# EAGLE design nodo_sensor_wa4_v1 (EAGLE 8.5.1)

## Sheet 1 of 3: ARDUINO Y COMUNICACION
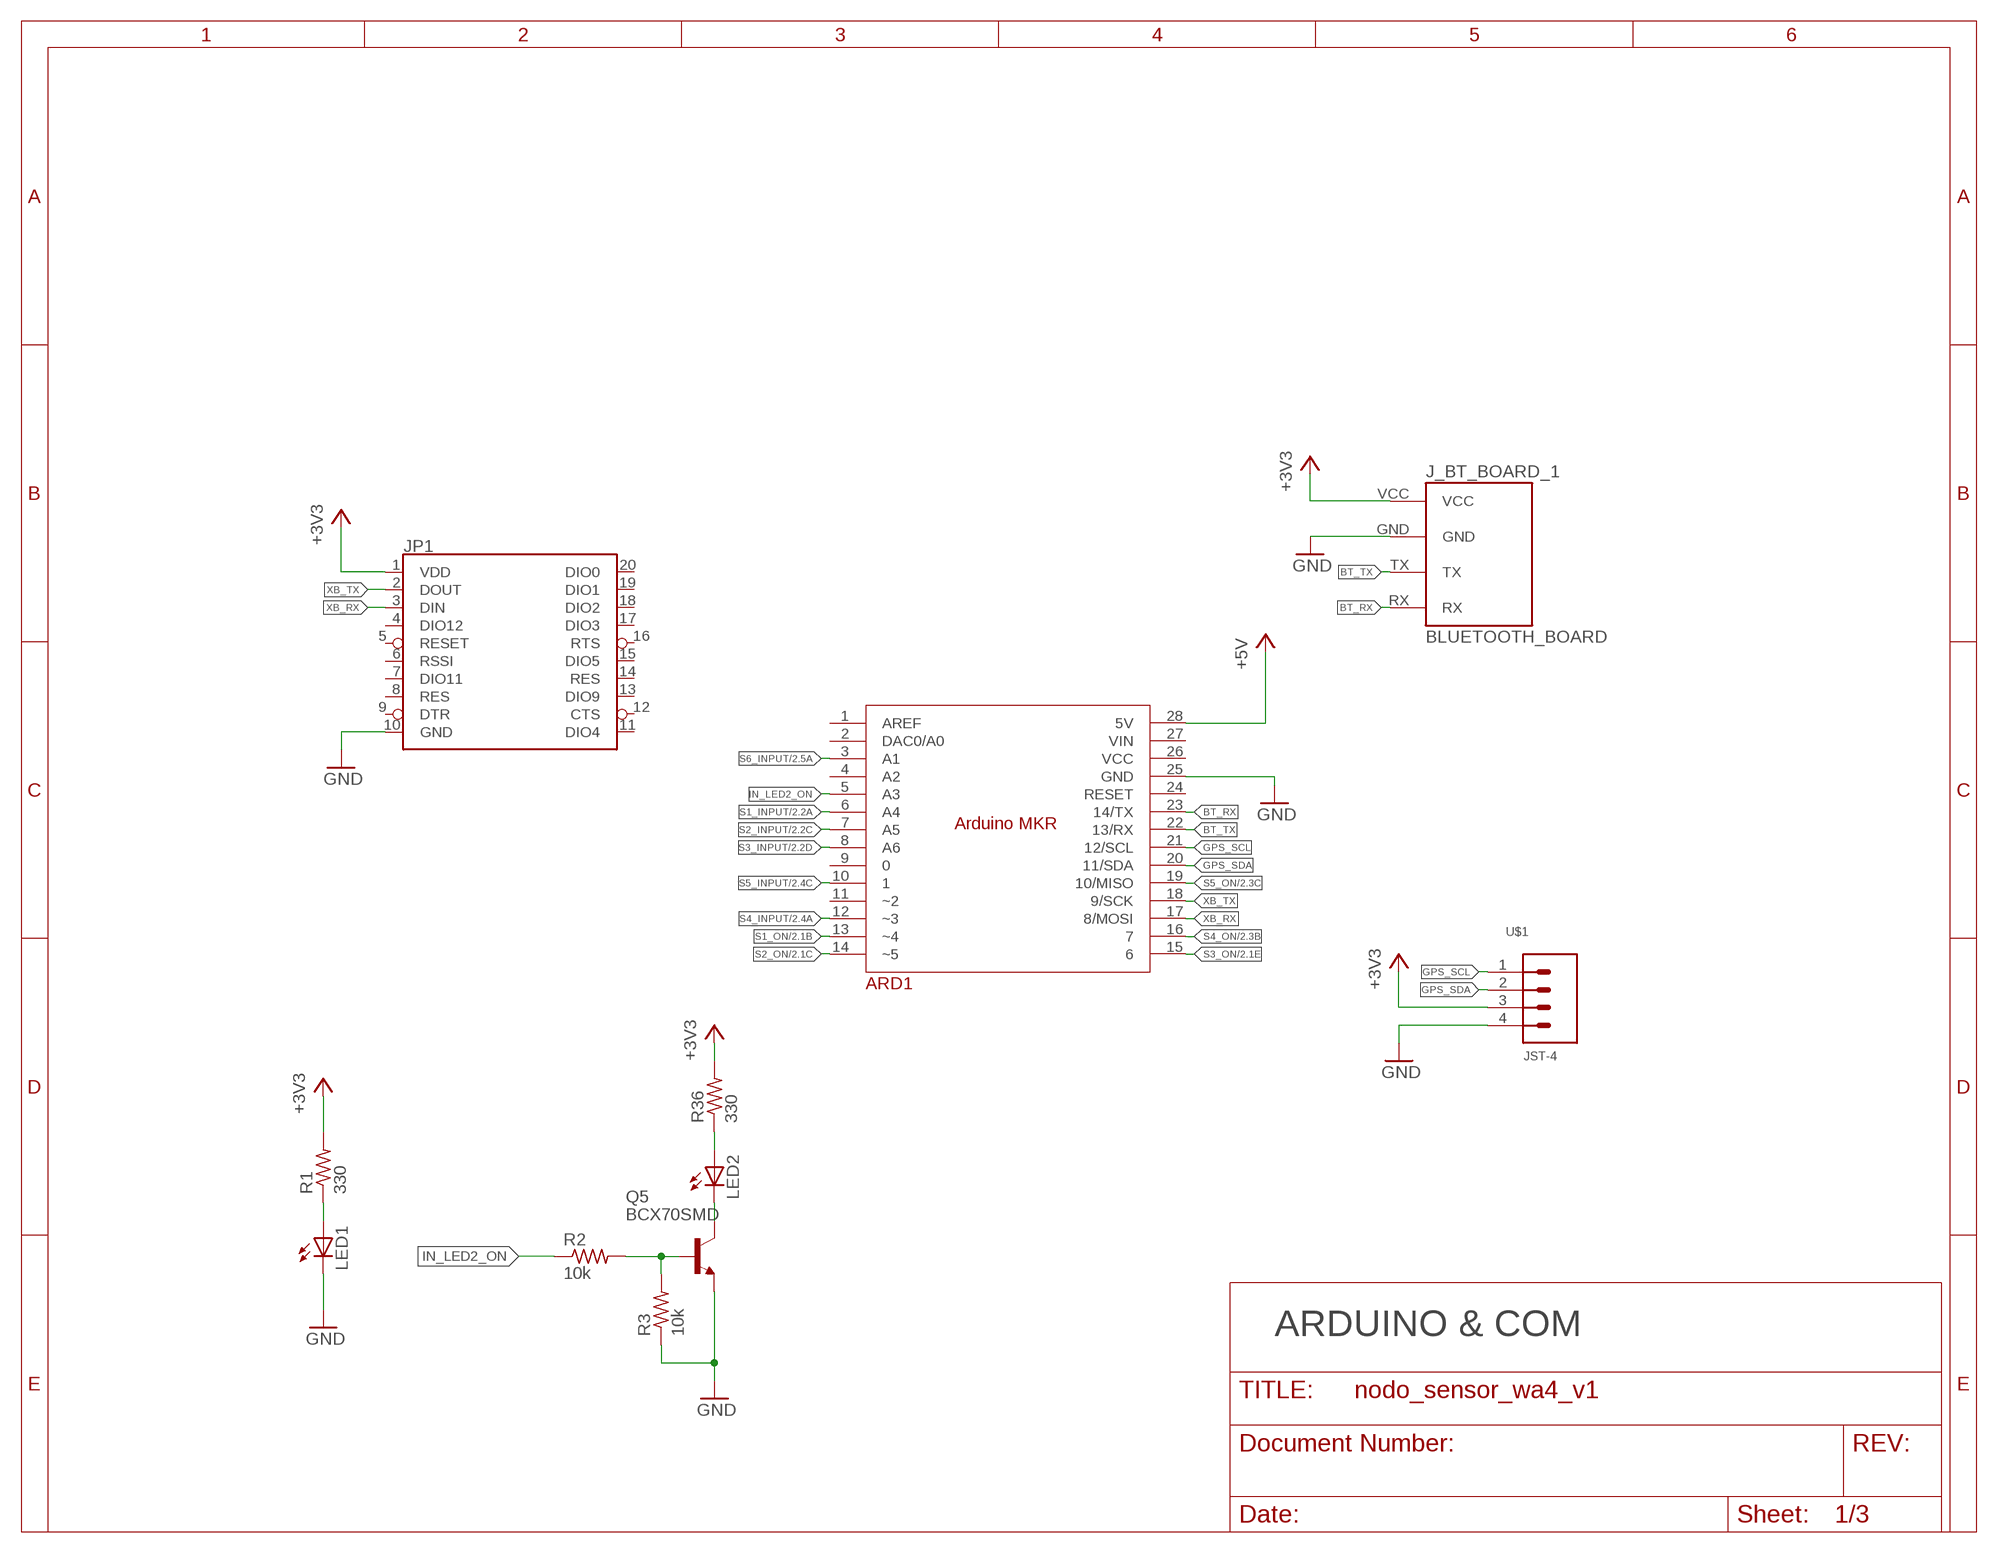
[diagram p0: schematic, sheet 1]

### Parts
ARD1  ARDUINO_MKR  [ARDUINO_MKR]
J_BT_BOARD_1  BLUETOOTH_BOARD  [BT_BOARD_FOOTPRINT]
JP1  XBEE  [XBEE]
LED1  LEDCHIP-LED0805  [CHIP-LED0805]
LED2  LEDCHIP-LED0805  [CHIP-LED0805]
Q5  BCX70SMD  [SOT23]
R1  330  R-US_R0805  [R0805]
R2  10k  R-US_R0805  [R0805]
R3  10k  R-US_R0805  [R0805]
R36  330  R-US_R0805  [R0805]
U$1  JST-4  [JST-4]

### Nets
+3V3: J_BT_BOARD_1.VCC JP1.1(VDD) R1.2 R36.2 U$1.3 ; also sheet 2,3
+5V: ARD1.28(5V) ; also sheet 3
BT_RX: ARD1.23(14/TX) J_BT_BOARD_1.RX
BT_TX: ARD1.22(13/RX) J_BT_BOARD_1.TX
GND: ARD1.25(GND) J_BT_BOARD_1.GND JP1.10(GND) LED1.C Q5.2(E) R3.1 U$1.4 ; also sheet 2,3
GPS_SCL: ARD1.21(12/SCL) U$1.1
GPS_SDA: ARD1.20(11/SDA) U$1.2
IN_LED2_ON: ARD1.5(A3) R2.1
N$38: LED2.A R36.1
N$39: LED2.C Q5.3(C)
N$40: LED1.A R1.1
N$48: Q5.1(B) R2.2 R3.2
S1_INPUT: ARD1.6(A4) ; also sheet 2
S1_ON: ARD1.13(~4) ; also sheet 2
S2_INPUT: ARD1.7(A5) ; also sheet 2
S2_ON: ARD1.14(~5) ; also sheet 2
S3_INPUT: ARD1.8(A6) ; also sheet 2
S3_ON: ARD1.15 ; also sheet 2
S4_INPUT: ARD1.12(~3) ; also sheet 2
S4_ON: ARD1.16 ; also sheet 2
S5_INPUT: ARD1.10 ; also sheet 2
S5_ON: ARD1.19(10/MISO) ; also sheet 2
S6_INPUT: ARD1.3(A1) ; also sheet 2
XB_RX: ARD1.17(8/MOSI) JP1.3(DIN)
XB_TX: ARD1.18(9/SCK) JP1.2(DOUT)
Unconnected: ARD1.1(AREF) ARD1.2(DAC0/A0) ARD1.4(A2) ARD1.9 ARD1.11(~2) ARD1.24(RESET) ARD1.26(VCC) ARD1.27(VIN) JP1.4(DIO12) JP1.5(RESET) JP1.6(RSSI) JP1.7(DIO11) JP1.8(RES) JP1.9(DTR) JP1.11(DIO4) JP1.12(CTS) JP1.13(DIO9) JP1.14(RES) JP1.15(DIO5) JP1.16(RTS) JP1.17(DIO3) JP1.18(DIO2) JP1.19(DIO1) JP1.20(DIO0)

### Notes on the sheet
- ARDUINO & COM

## Sheet 2 of 3: SENSORES
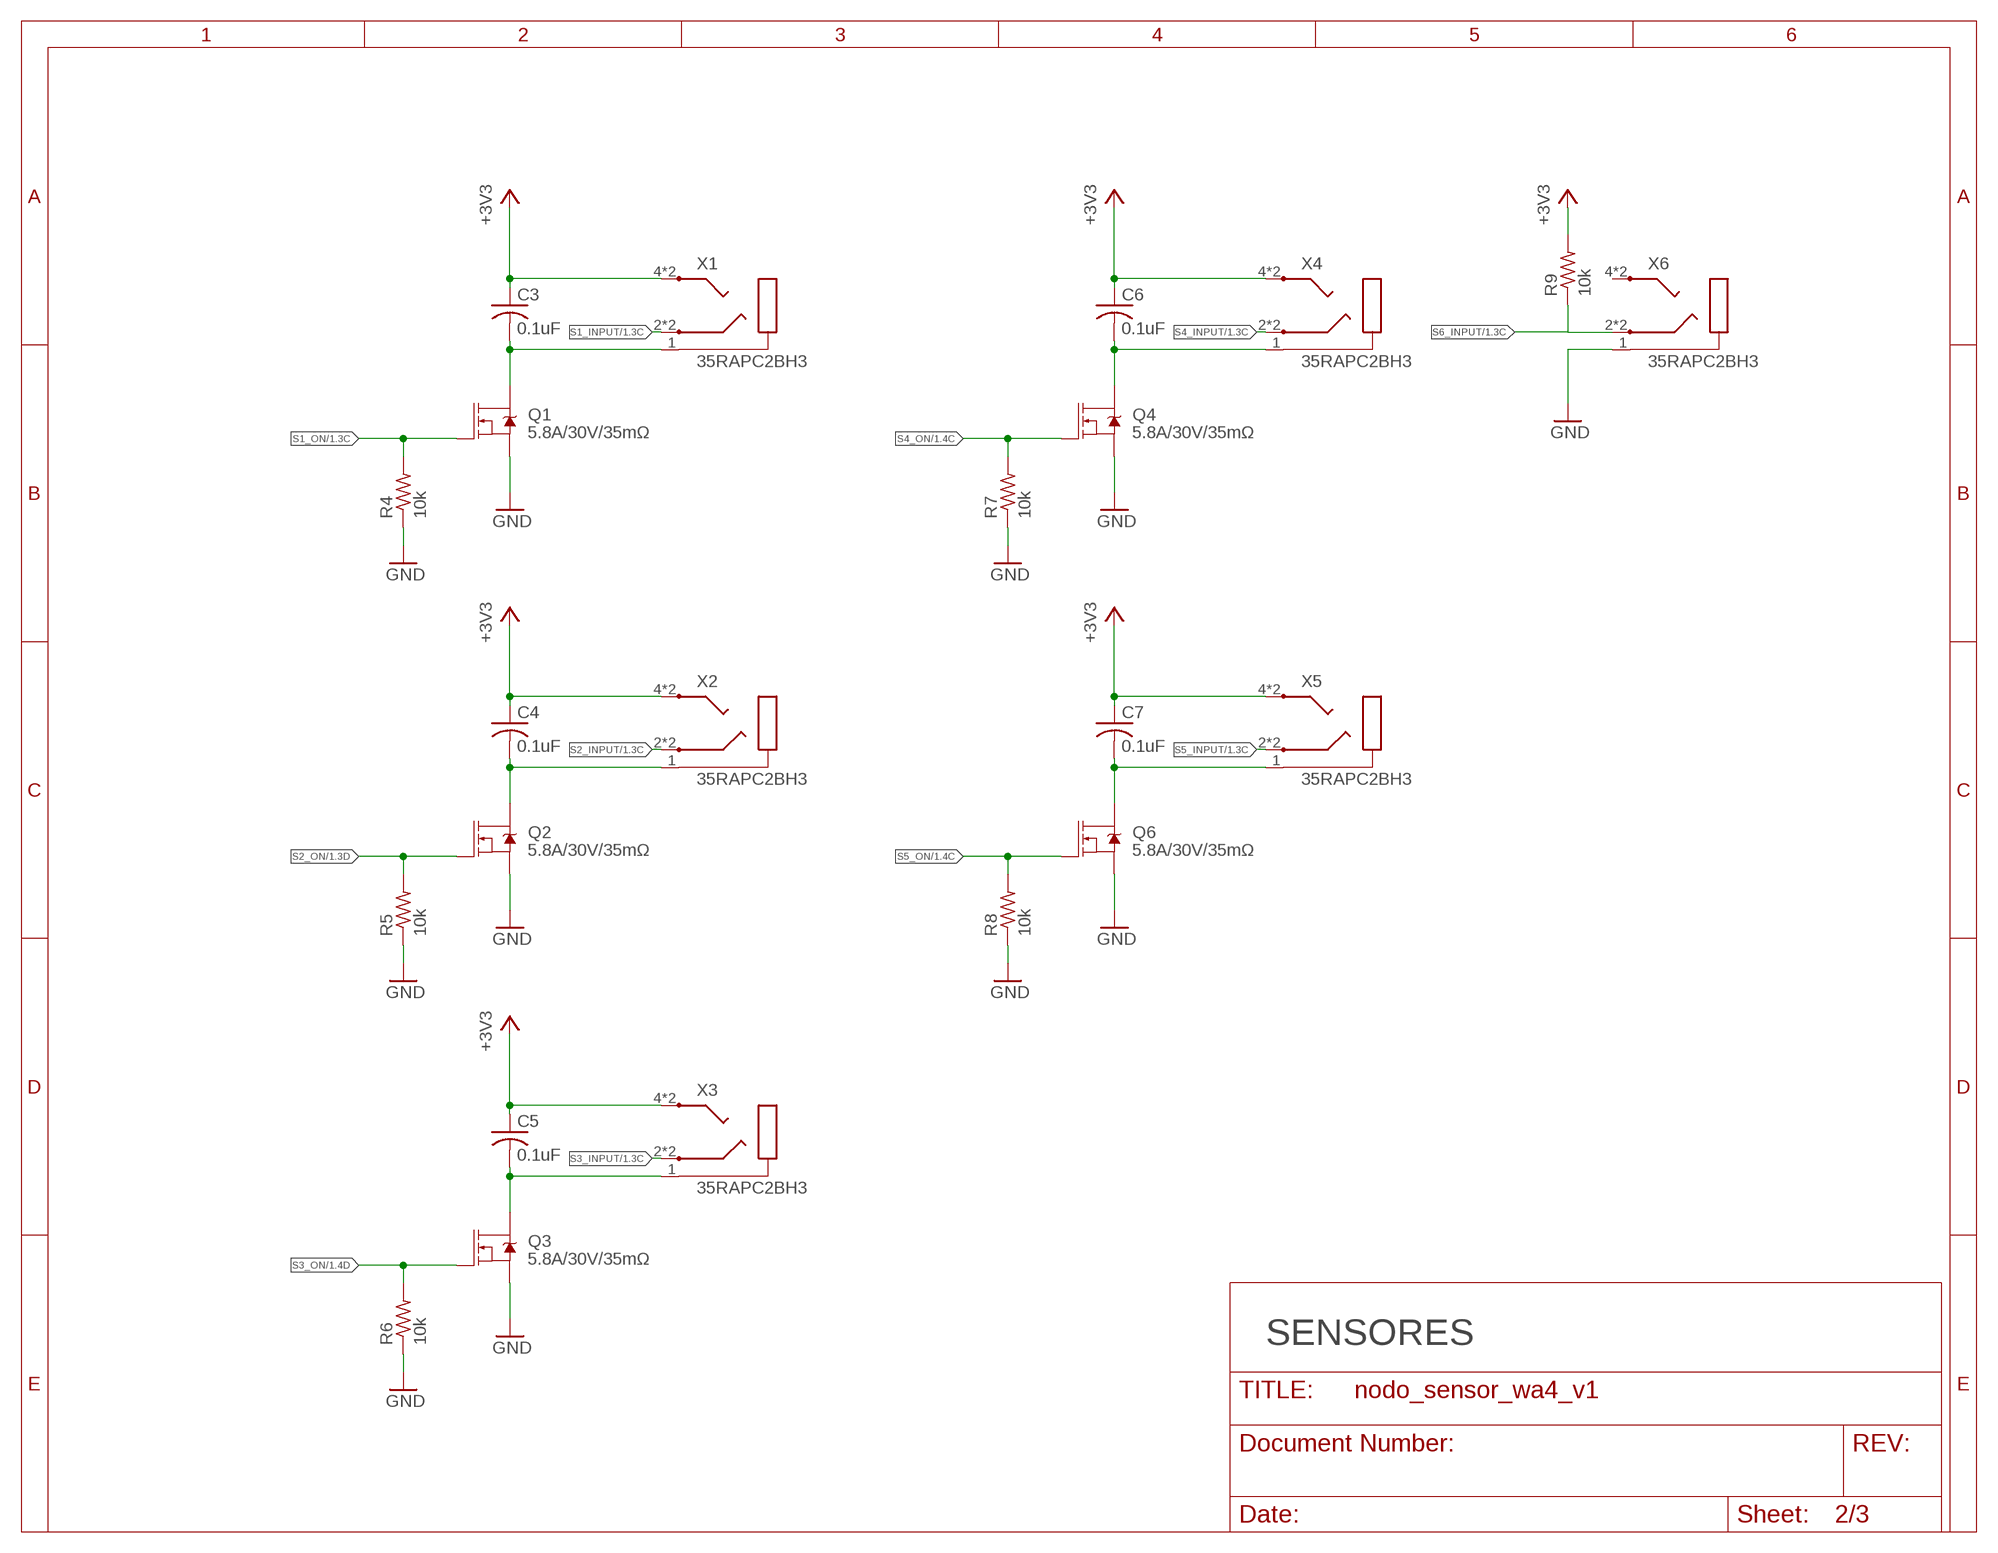
[diagram p1: schematic, sheet 2]

### Parts
C3  0.1uF  C-USC0805  [C0805]
C4  0.1uF  C-USC0805  [C0805]
C5  0.1uF  C-USC0805  [C0805]
C6  0.1uF  C-USC0805  [C0805]
C7  0.1uF  C-USC0805  [C0805]
Q1  5.8A/30V/35mΩ  MOSFET-NCH-AO3404A  [SOT23-3]
Q2  5.8A/30V/35mΩ  MOSFET-NCH-AO3404A  [SOT23-3]
Q3  5.8A/30V/35mΩ  MOSFET-NCH-AO3404A  [SOT23-3]
Q4  5.8A/30V/35mΩ  MOSFET-NCH-AO3404A  [SOT23-3]
Q6  5.8A/30V/35mΩ  MOSFET-NCH-AO3404A  [SOT23-3]
R4  10k  R-US_R0805  [R0805]
R5  10k  R-US_R0805  [R0805]
R6  10k  R-US_R0805  [R0805]
R7  10k  R-US_R0805  [R0805]
R8  10k  R-US_R0805  [R0805]
R9  10k  R-US_R0805  [R0805]
X1  35RAPC2BH3  [35RAPC2BH3]
X2  35RAPC2BH3  [35RAPC2BH3]
X3  35RAPC2BH3  [35RAPC2BH3]
X4  35RAPC2BH3  [35RAPC2BH3]
X5  35RAPC2BH3  [35RAPC2BH3]
X6  35RAPC2BH3  [35RAPC2BH3]

### Nets
+3V3: C3.1 C4.1 C5.1 C6.1 C7.1 R9.2 X1.4 X1.5 X2.4 X2.5 X3.4 X3.5 X4.4 X4.5 X5.4 X5.5 ; also sheet 1,3
GND: Q1.2(S) Q2.2(S) Q3.2(S) Q4.2(S) Q6.2(S) R4.1 R5.1 R6.1 R7.1 R8.1 X6.1 ; also sheet 1,3
N$1: C3.2 Q1.3(D) X1.1
N$2: C4.2 Q2.3(D) X2.1
N$3: C5.2 Q3.3(D) X3.1
N$4: C6.2 Q4.3(D) X4.1
N$5: C7.2 Q6.3(D) X5.1
S1_INPUT: X1.2 X1.3 ; also sheet 1
S1_ON: Q1.1(G) R4.2 ; also sheet 1
S2_INPUT: X2.2 X2.3 ; also sheet 1
S2_ON: Q2.1(G) R5.2 ; also sheet 1
S3_INPUT: X3.2 X3.3 ; also sheet 1
S3_ON: Q3.1(G) R6.2 ; also sheet 1
S4_INPUT: X4.2 X4.3 ; also sheet 1
S4_ON: Q4.1(G) R7.2 ; also sheet 1
S5_INPUT: X5.2 X5.3 ; also sheet 1
S5_ON: Q6.1(G) R8.2 ; also sheet 1
S6_INPUT: R9.1 X6.2 X6.3 ; also sheet 1
Unconnected: X6.4 X6.5

### Notes on the sheet
- SENSORES

## Sheet 3 of 3: FUENTES
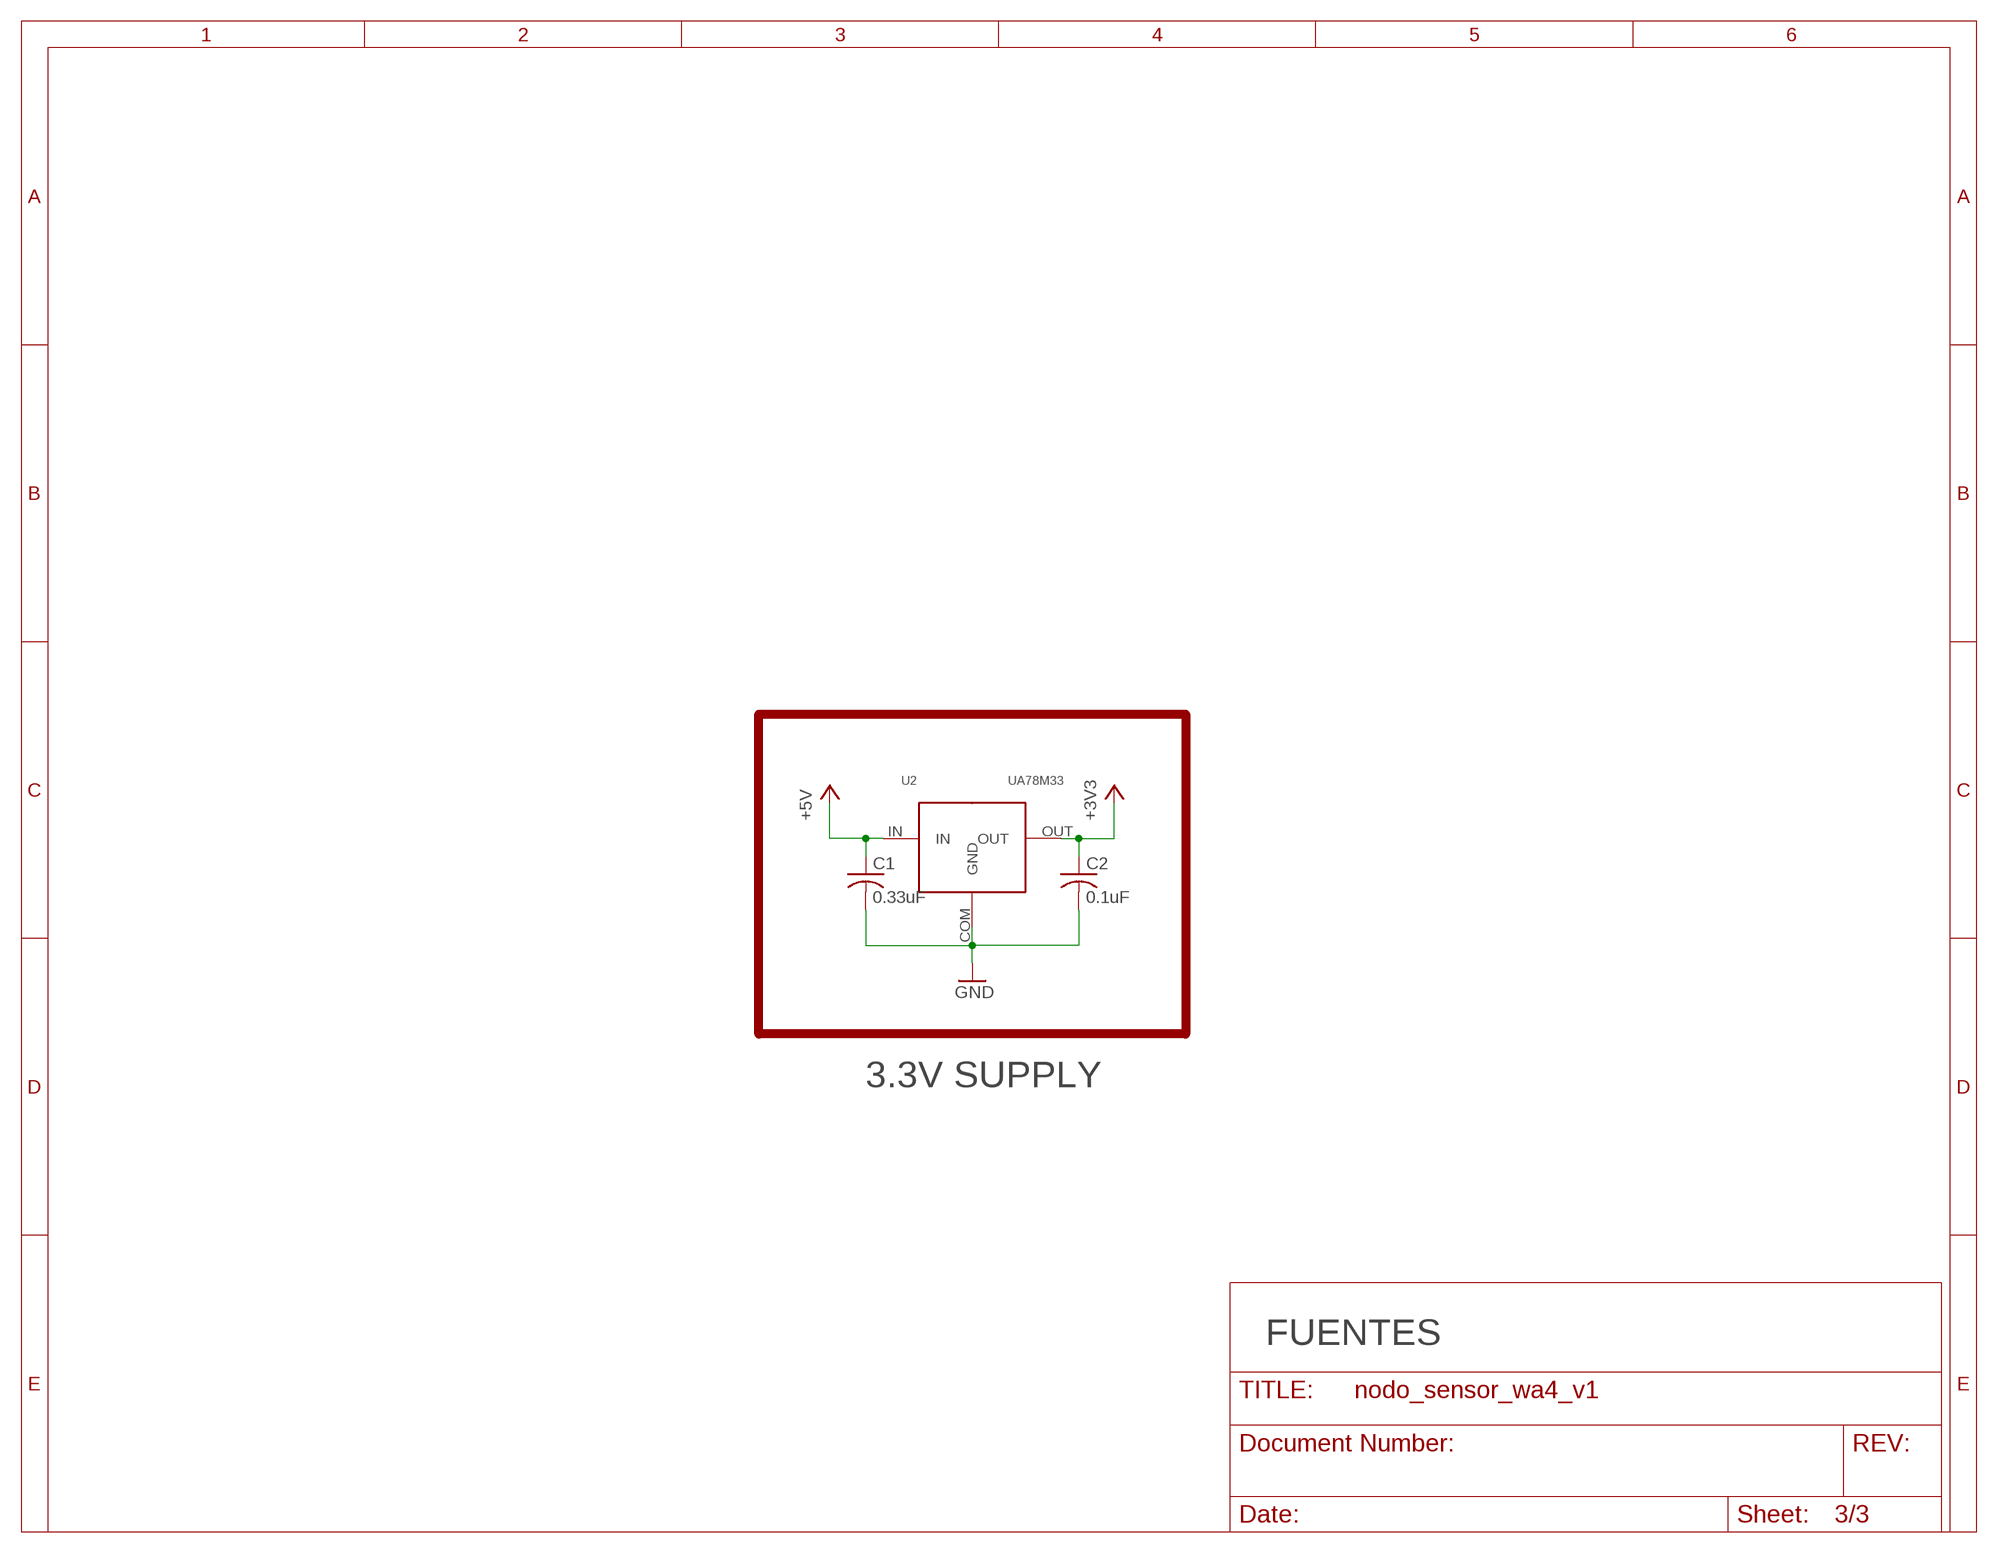
[diagram p2: schematic, sheet 3]

### Parts
C1  0.33uF  C-USC0805  [C0805]
C2  0.1uF  C-USC0805  [C0805]
U2  UA78M33  [UA78XX]

### Nets
+3V3: C2.1 U2.OUT ; also sheet 1,2
+5V: C1.1 U2.IN ; also sheet 1
GND: C1.2 C2.2 U2.COM(GND) ; also sheet 1,2

### Notes on the sheet
- 3.3V SUPPLY
- FUENTES

## Library data of the parts
ARD1 = Arduino_MKR:ARDUINO_MKR
C1-C7 = resistor:C-US: CAPACITOR, American symbol
J_BT_BOARD_1 = Bluetooth HC-05:BLUETOOTH_BOARD: Bluetooth Board V1.05
JP1 = SparkFun-RF:XBEE: Digi XBee and XBee Pro XBees are tiny blue chips that can communicate wirelessly with each other. They can do simple things, like replacing a couple of wires in serial communication, which is nice when you want to make a remote for your paintball vehicle. SparkFun Products SparkFun XBee Buying Guide <https://www.sparkfun.com/pages/xbee_guide> SparkFun XBee Explorer USB <https://www.sparkfun.com/products/11812> (WRL-11812) Breakout Board for XBee Module <https://www.sparkfun.com/products/8276> (WRL-8276) SparkFun XBee Explorer Regulated <https://www.sparkfun.com/products/11373> (WRL-11373) SparkFun XBee Explorer Dongle <https://www.sparkfun.com/products/11697> (WRL-11697) SparkFun XBee Shield <https://www.sparkfun.com/products/12847> (WRL-12847) SparkFun XBee Explorer Serial <https://www.sparkfun.com/products/13225> (WRL-13225)
LED1 LED2 = led:LED: LED OSRAM: - CHIPLED LG R971, LG N971, LY N971, LG Q971, LY Q971, LO R971, LY R971 LH N974, LH R974 LS Q976, LO Q976, LY Q976 LO Q996 - Hyper CHIPLED LW Q18S LB Q993, LB Q99A, LB R99A - SideLED LS A670, LO A670, LY A670, LG A670, LP A670 LB A673, LV A673, LT A673, LW A673 LH A674 LY A675 LS A676, LA A676, LO A676, LY A676, LW A676 LS A679, LY A679, LG A679 - Hyper Micro SIDELED® LS Y876, LA Y876, LO Y876, LY Y876 LT Y87S - SmartLED LW L88C, LW L88S LB L89C, LB L89S, LG L890 LS L89K, LO L89K, LY L89K LS L896, LA L896, LO L896, LY L896 - TOPLED LS T670, LO T670, LY T670, LG T670, LP T670 LSG T670, LSP T670, LSY T670, LOP T670, LYG T670 LG T671, LOG T671, LSG T671 LB T673, LV T673, LT T673, LW T673 LH T674 LS T676, LA T676, LO T676, LY T676, LB T676, LH T676, LSB T676, LW T676 LB T67C, LV T67C, LT T67C, LS T67K, LO T67K, LY T67K, LW E67C LS E67B, LA E67B, LO E67B, LY E67B, LB E67C, LV E67C, LT E67C LW T67C LS T679, LY T679, LG T679 LS T770, LO T770, LY T770, LG T770, LP T770 LB T773, LV T773, LT T773, LW T773 LH T774 LS E675, LA E675, LY E675, LS T675 LS T776, LA T776, LO T776, LY T776, LB T776 LHGB T686 LT T68C, LB T68C - Hyper Mini TOPLED® LB M676 - Mini TOPLED Santana® LG M470 LS M47K, LO M47K, LY M47K Source: http://www.osram.convergy.de LUXEON: - LUMILED® LXK2-PW12-R00, LXK2-PW12-S00, LXK2-PW14-U00, LXK2-PW14-V00 LXK2-PM12-R00, LXK2-PM12-S00, LXK2-PM14-U00 LXK2-PE12-Q00, LXK2-PE12-R00, LXK2-PE12-S00, LXK2-PE14-T00, LXK2-PE14-U00 LXK2-PB12-K00, LXK2-PB12-L00, LXK2-PB12-M00, LXK2-PB14-N00, LXK2-PB14-P00, LXK2-PB14-Q00 LXK2-PR12-L00, LXK2-PR12-M00, LXK2-PR14-Q00, LXK2-PR14-R00 LXK2-PD12-Q00, LXK2-PD12-R00, LXK2-PD12-S00 LXK2-PH12-R00, LXK2-PH12-S00 LXK2-PL12-P00, LXK2-PL12-Q00, LXK2-PL12-R00 Source: www.luxeon.com KINGBRIGHT: KA-3528ASYC Source: www.kingbright.com
Q1-Q4 Q6 = SparkFun-DiscreteSemi:MOSFET-NCH: N-channel MOSFETs Voltage controlled devices that allow control of high current outputs. SparkFun Products: SparkFun OpenScale <https://www.sparkfun.com/products/13261> SparkFun Digital Sandbox <https://www.sparkfun.com/products/12651> SparkFun Monster Moto Shield <https://www.sparkfun.com/products/10182> SparkFun MOSFET Power Controller <https://www.sparkfun.com/products/11214>; PROD_ID: TRANS-12988
Q5 = transistor-npn:BCX70*: NPN Transistor
R1-R9 R36 = resistor:R-US_: RESISTOR, American symbol
U2 = actuador:UA78M33
U$1 = actuador:JST-4
X1-X6 = actuador:35RAPC2BH3

## Board
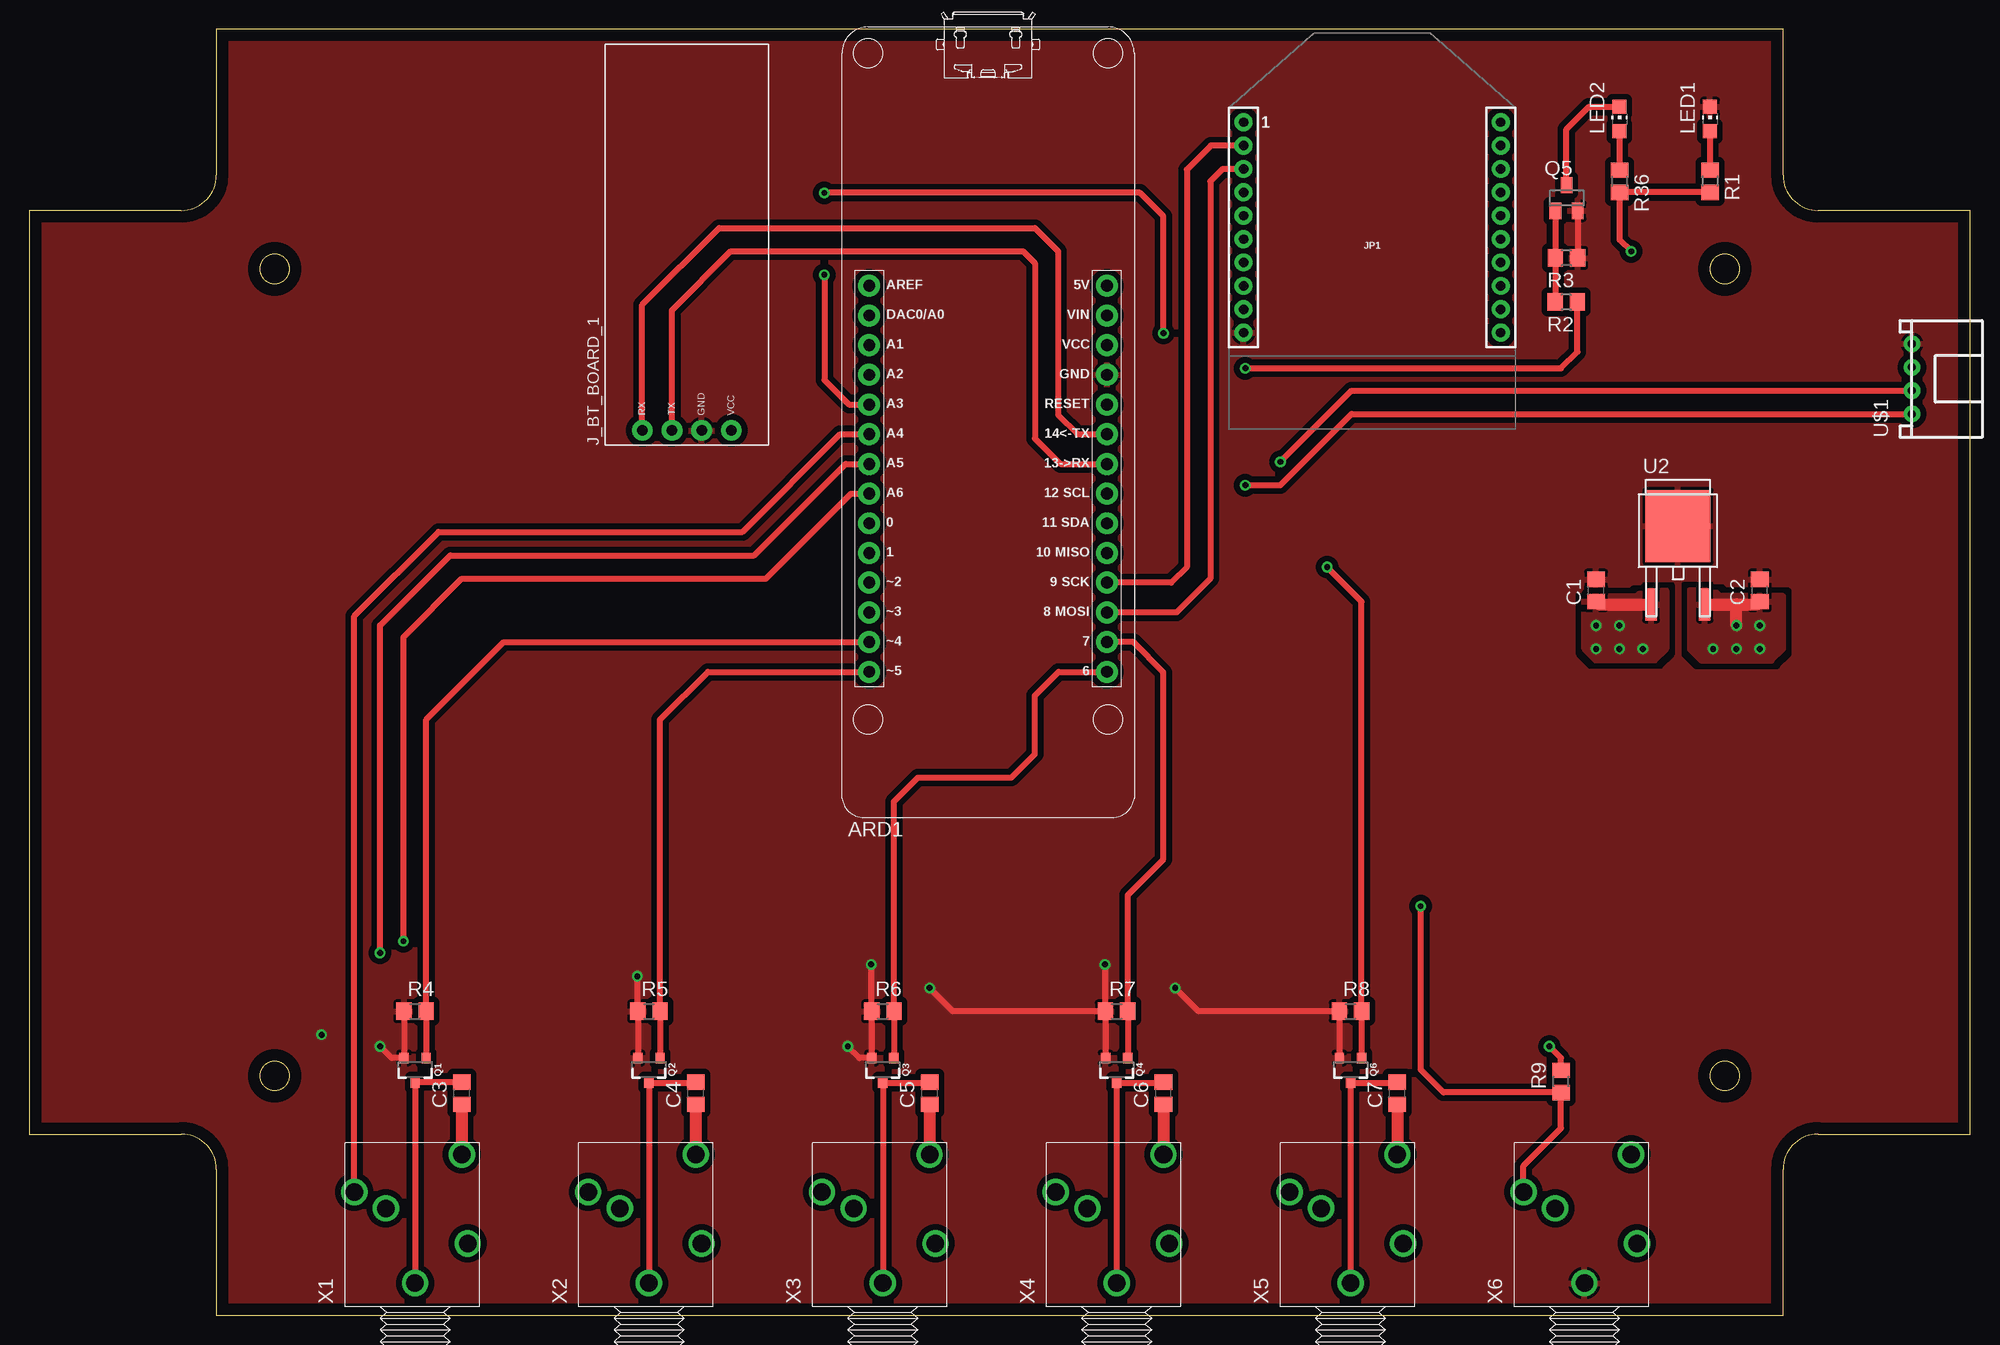
[diagram p3: board, top side]
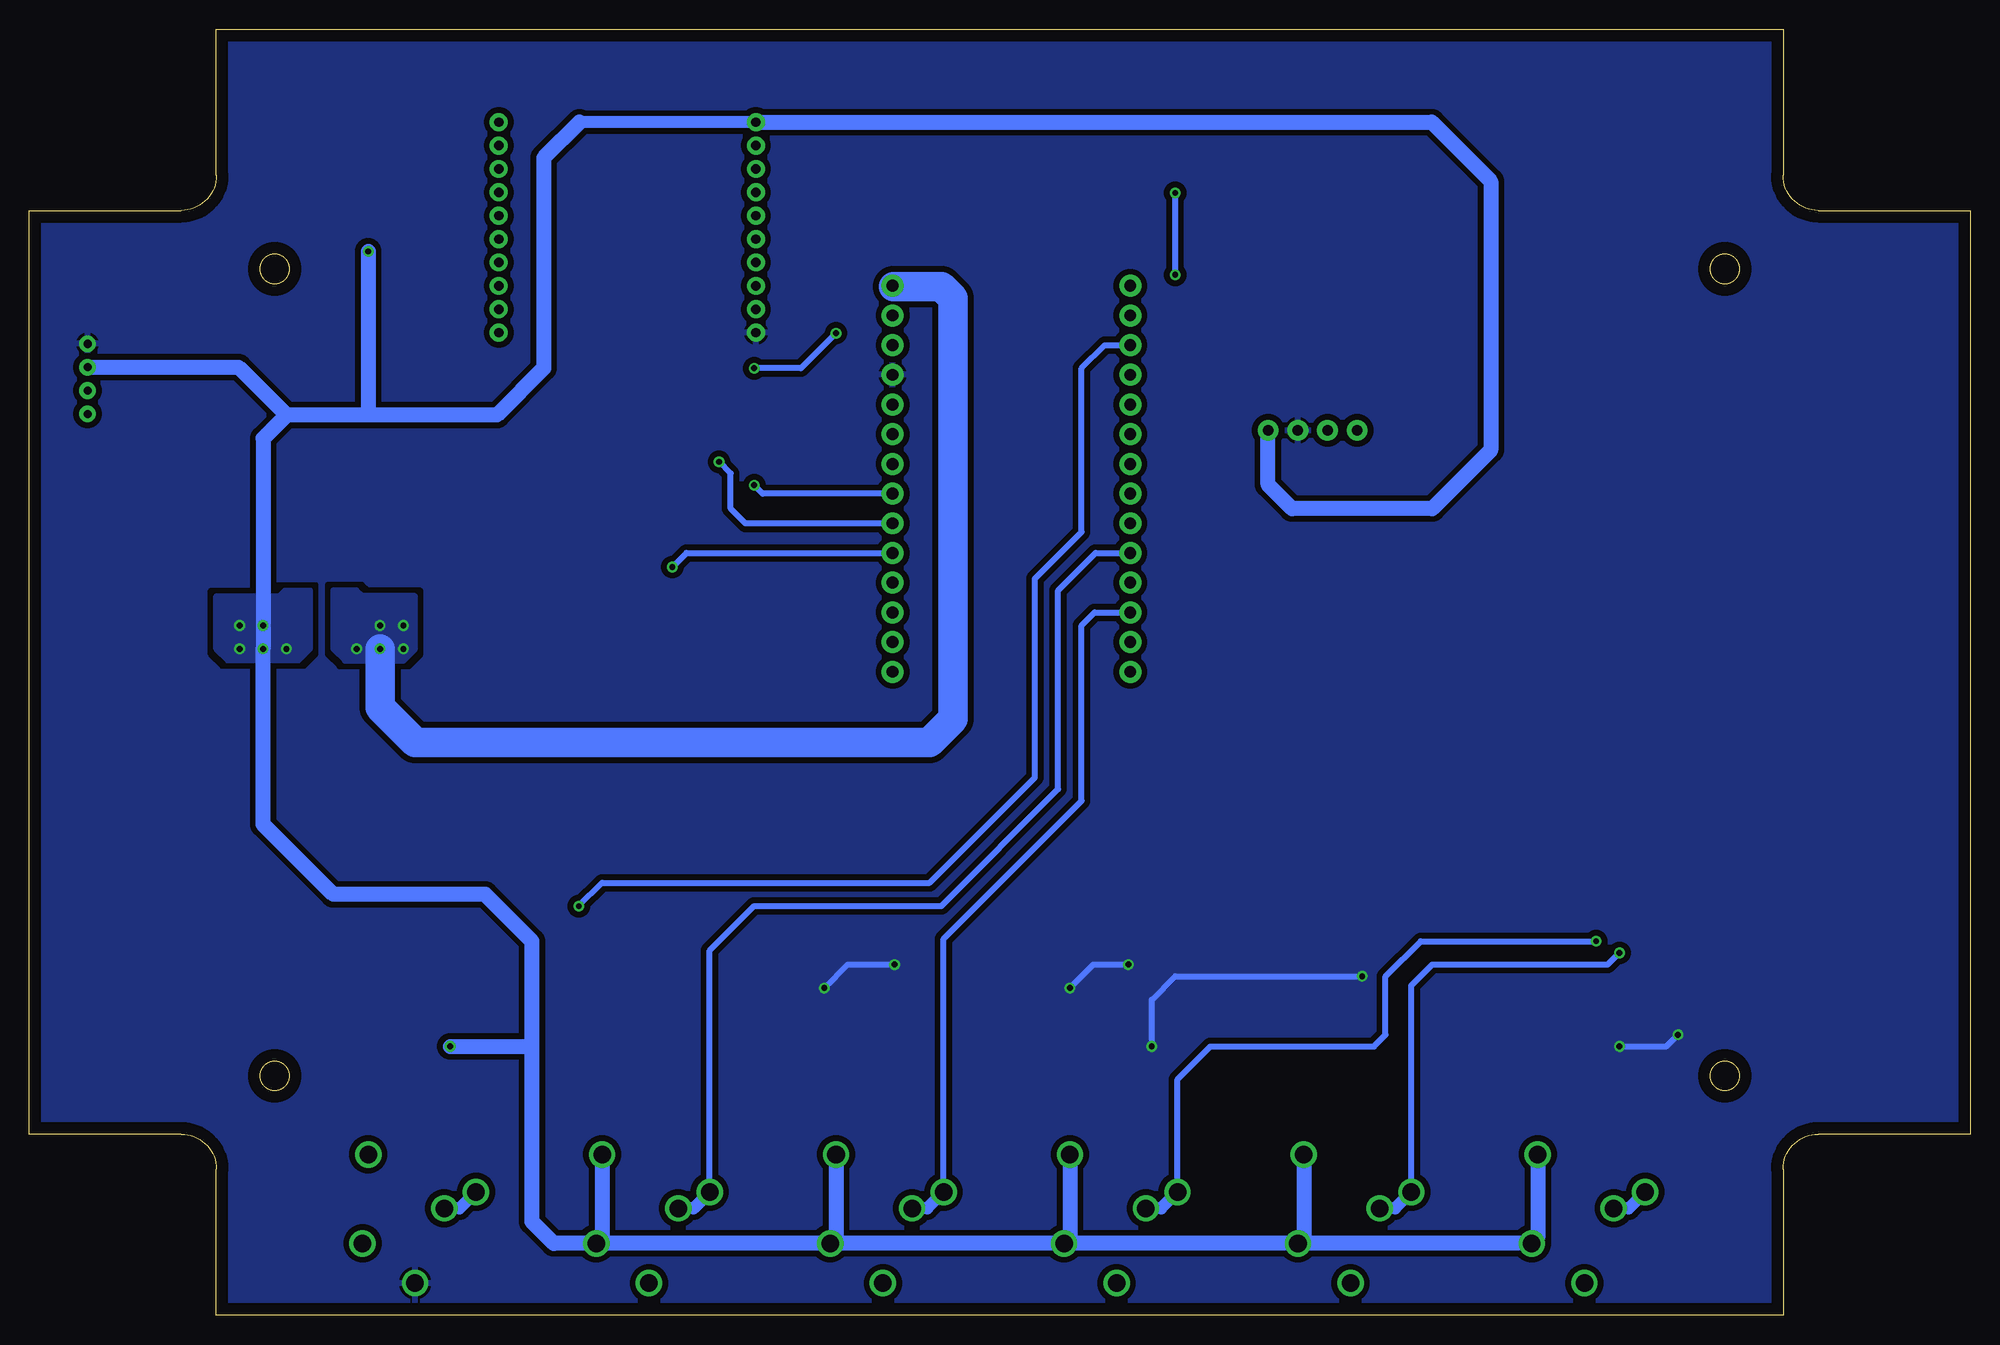
[diagram p4: board, bottom side, seen from below]

Size 166 x 110 mm. Coordinates in mm from the lower left corner, seen from the top.
Outline: 13,94.5 arc90 16,97.5 16,110 150,110 150,97.5 arc90 153,94.5 166,94.5 166,15.5 153,15.5 arc90 150,12.5 150,0 16,0 16,12.5 arc90 13,15.5 0,15.5 0,94.5 13,94.5
Outline: circle at 21,20.5 radius 1.25
Outline: circle at 145,89.5 radius 1.25
Outline: circle at 21,89.5 radius 1.25
Outline: circle at 145,20.5 radius 1.25
Copper layers (1*16): Top 0.035mm / dielectric 1.5mm / Bottom 0.035mm
Design rules "default *": minimum track width 6mil, minimum drill 0.5mm, track to track 6mil, track to pad 6mil, pad to pad 6mil, via to via 6mil, smd to smd 6mil, copper to edge 40mil, drill to drill 6mil, minimum pad ring 10mil, minimum via ring 8mil, stop-mask expansion 4mil, vias tented up to drill 0.5mm, thermal gap 10mil

### Footprints (pad centres in the part's own frame; a part is rotated, then mirrored left to right if it is on the bottom)
ARDUINO_MKR = drill 1.016 pad 1.88: 1 -10.16,11.04; 2 -10.16,8.5; 3 -10.16,5.96; 4 -10.16,3.42; 5 -10.16,0.88; 6 -10.16,-1.66; 7 -10.16,-4.2; 8 -10.16,-6.74; 9 -10.16,-9.28; 10 -10.16,-11.82; 11 -10.16,-14.36; 12 -10.16,-16.9; 13 -10.16,-19.44; 14 -10.16,-21.98; 15 10.16,-21.98; 16 10.16,-19.44; 17 10.16,-16.9; 18 10.16,-14.36; 19 10.16,-11.82; 20 10.16,-9.28; 21 10.16,-6.74; 22 10.16,-4.2; 23 10.16,-1.66; 24 10.16,0.88; 25 10.16,3.42; 26 10.16,5.96; 27 10.16,8.5; 28 10.16,11.04
C0805 = smd 1.3 x 1.5: 1 -0.95,0; 2 0.95,0
BT_BOARD_FOOTPRINT = drill 0.9 pad 1.778: GND -16.51,-1.27; RX -16.51,3.81; TX -16.51,1.27; VCC -16.51,-3.81
XBEE = drill 0.8 pad 1.524: 1 -11,20; 2 -11,18; 3 -11,16; 4 -11,14; 5 -11,12; 6 -11,10; 7 -11,8; 8 -11,6; 9 -11,4; 10 -11,2; 11 11,2; 12 11,4; 13 11,6; 14 11,8; 15 11,10; 16 11,12; 17 11,14; 18 11,16; 19 11,18; 20 11,20
CHIP-LED0805 = smd 1.2 x 1.2: A 0,-1.05; C 0,1.05
SOT23-3 = smd 0.8 x 0.9: 1 -0.95,-1; 2 0.95,-1; 3 0,1.1
SOT23 = smd 1 x 1.4: 1 -0.95,-1.1; 2 0.95,-1.1; 3 0,1.1
R0805 = smd 1.3 x 1.5: 1 -0.95,0; 2 0.95,0
UA78XX = smd 5.55 x 6.15: COM 0,2.5 | smd 1 x 2.72: IN -2.29,-4.2; OUT 2.29,-4.2
JST-4 = drill 0.7 pad 1.422: 1 -3,0; 2 -1,0; 3 1,0; 4 3,0
35RAPC2BH3 = drill 1.5: 1 -3.25,0; 2 4.55,5.2; 3 3.15,2.5; 4 7.75,-4; 5 0.15,-4.5

### Placement (x,y rotation side)
ARD1  82,77.02 0 top
C1  134,62 90 top
C2  148,62 90 top
C3  37,19 90 top
C4  57,19 90 top
C5  77,19 90 top
C6  97,19 90 top
C7  117,19 90 top
J_BT_BOARD_1  56.24,92.2 90 top
JP1  114.85,82.05 0 top
LED1  143.74,102.32 0 top
LED2  136,102.32 0 top
Q1  33,21 180 top
Q2  53,21 180 top
Q3  73,21 180 top
Q4  93,21 180 top
Q5  131.47,95.56 0 top
Q6  113,21 180 top
R1  143.74,97 270 top
R2  131.45,86.66 180 top
R3  131.47,90.44 180 top
R4  33,26 0 top
R5  53,26 0 top
R6  73,26 0 top
R7  93,26 0 top
R8  113,26 0 top
R9  131,20 90 top
R36  136,97 270 top
U2  141,65 0 top
U$1  161.01,80.09 90 top
X1  33,6 90 top
X2  53,6 90 top
X3  73,6 90 top
X4  93,6 90 top
X5  113,6 90 top
X6  133,6 90 top

### Tracks (layer width: path | path; a pad name or v marks a point on that pad's centre or on a via)
+3V3  (via drill 0.5)
  Top 0.508: 147.75,60.8 C2.1 | R9.2 131,22 v130,23 | R1.2 R36.2 136,92 v137,91
  Top 1.016: C3.1 X1.4 | C4.1 X2.4 | C5.1 X3.4 | C6.1 X4.4 | C7.1 X5.4 | U2.OUT 146,60.8 | 146,60.8 147.75,60.8 | v146,59 146,60.8
  Bottom 1.016: JP1.1 118.95,102.05
  Bottom 1.27: X1.4 37,6.65 X1.5 X2.5 | X2.4 57,6.65 X2.5 | X3.4 77,6.65 X3.5 | X4.4 97,6.65 X4.5 | X5.4 117,6.65 X5.5 | X2.5 X3.5 | X3.5 X4.5 | X4.5 X5.5 | X5.5 121.15,6.15 123,8 123,23 | 123,23 123,32 127,36 140,36 146,42 v146,57 146,75 144,77 | JP1.1 46.05,102.05 41,97 41,74 46,69 58,69 60.05,71.05 J_BT_BOARD_1.VCC | 118.95,102.05 122,99 122,81 126,77 137,77 | 137,77 144,77 | U$1.3 148.09,81.09 144,77 | v130,23 123,23 | v137,91 137,77
  other vias: 144,57 148,59 148,57
  pour Top: 142,62 142,57 143,56 149,56 150,57 150,61.5 144.6,61.5 144.1,62
  pour Bottom: 142,62 142,57 143,56 149,56 150,57 150,61.5 144.6,61.5 144.1,62
+5V  (via drill 0.5)
  Top 0.508: C1.1 134.25,60.8
  Top 1.016: 134.25,60.8 U2.IN
  Bottom 0.508: ARD1.28 92.1,88
  Bottom 2.54: 92.1,88 88,88 87,87 87,51 89,49 133,49 136,52 v136,57
  other vias: 134,59 134,57 136,59 138,57
  pour Top: 140,62 140,57 139,56 134,56 133,57 133,61.5 137.5,61.5 138,62
  pour Bottom: 140,62 140,57 139,56 134,56 133,57 133,61.5 137.5,61.5 138,62
BT_RX
  Top 0.508: J_BT_BOARD_1.RX 52.43,86.43 59,93 86,93 88,91 88,77 89.64,75.36 ARD1.23
BT_TX
  Top 0.508: J_BT_BOARD_1.TX 54.97,85.97 60,91 85,91 86,90 86,75 88.18,72.82 ARD1.22
GND  (via drill 0.5)
  Top 0.508: R4.1 Q1.2 31,22 v30,23 | Q2.2 R5.1 52,26.05 v52,29 | R7.1 Q4.2 | Q6.2 R8.1 100,26 v98,28 | Q5.2 R3.1 | v70,23 71,22 Q3.2 R6.1 72,26.05 v72,30 | R7.1 79,26 v77,28 | v92,30 92,26.05 R7.1
  Bottom 0.508: v30,23 26,23 v25,24 | v70,23 70,27 68,29 v52,29 | v77,28 75,30 v72,30 | v98,28 96,30 v92,30
  pour Top (isolate 0.5, rank 3): 16,110 150,110 150,103 150,97.5 arc90 153,94.5 160.1,94.5 166,94.5 166,91.8 166,15.5 161,15.5 153,15.5 arc90 150,12.5 150,9.3 150,0 146.5,0 16,0 16,3.4 16,12.5 arc90 13,15.5 8.4,15.5 0,15.5 0,18.1 0,94.5 6.6,94.5 13,94.5 arc90 16,97.5 16,102.6
  pour Bottom (isolate 0.5, rank 3): 16,110 150,110 150,97.5 arc90 153,94.5 166,94.5 166,15.5 153,15.5 arc90 150,12.5 150,0 16,0 16,12.5 arc90 13,15.5 0,15.5 0,94.5 13,94.5 arc90 16,97.5
GPS_SCL  (via drill 0.5)
  Top 0.508: v104,71 107,71 113.09,77.09 U$1.1
  Bottom 0.508: ARD1.21 103.28,70.28 v104,71
GPS_SDA  (via drill 0.5)
  Top 0.508: v107,73 113.09,79.09 U$1.2
  Bottom 0.508: ARD1.20 104.74,67.74 106,69 106,72 v107,73
IN_LED2_ON  (via drill 0.5)
  Top 0.508: v104,81 131,81 132.4,82.4 R2.1 | v97,84 97,94 95,96 v68,96 | v68,89 68,80 70.1,77.9 ARD1.5
  Bottom 0.508: v97,84 100,81 v104,81 | v68,96 v68,89
N$1
  Top 0.508: C3.2 33.05,19.95 Q1.3 X1.1
N$2
  Top 0.508: C4.2 56.95,19.9 Q2.3 X2.1
N$3
  Top 0.508: C5.2 76.95,19.9 Q3.3 X3.1
N$4
  Top 0.508: C6.2 96.95,19.9 Q4.3 X4.1
N$5
  Top 0.508: C7.2 116.95,19.9 Q6.3 X5.1
N$38
  Top 0.508: LED2.A R36.1
N$39
  Top 0.508: Q5.3 131.47,101.47 133.37,103.37 LED2.C
N$40
  Top 0.508: LED1.A R1.1
N$48
  Top 0.508: Q5.1 R3.2 130.52,86.68 R2.2
S1_INPUT
  Top 0.508: X1.2 27.8,59.8 35,67 61,67 69.36,75.36 ARD1.6
  Bottom 1.016: X1.2 29.2,9.15 X1.3
S1_ON
  Top 0.508: Q1.1 R4.2 33.95,50.95 40.58,57.58 ARD1.13
S2_INPUT  (via drill 0.5)
  Top 0.508: v30,31 30,59 36,65 62,65 69.82,72.82 ARD1.7
  Bottom 0.508: X2.2 47.8,28.2 46,30 31,30 v30,31
  Bottom 1.016: X2.2 49.2,9.15 X2.3
S2_ON
  Top 0.508: Q2.1 R5.2 53.95,50.95 58.04,55.04 ARD1.14
S3_INPUT  (via drill 0.5)
  Top 0.508: v32,32 32,58 37,63 63,63 70.28,70.28 ARD1.8
  Bottom 0.508: X3.2 67.8,20.2 65,23 51,23 50,24 50,29 47,32 v32,32
  Bottom 1.016: X3.2 69.2,9.15 X3.3
S3_ON
  Top 0.508: Q3.1 R6.2 73.95,43.95 76,46 84,46 86,48 86,53 88.04,55.04 ARD1.15
S4_INPUT
  Bottom 0.508: X4.2 87.8,32.2 76,44 76,59 74.88,60.12 ARD1.12
  Bottom 1.016: X4.2 89.2,9.15 X4.3
S4_ON
  Top 0.508: Q4.1 R7.2 93.95,35.95 97,39 97,55 94.42,57.58 ARD1.16
S5_INPUT
  Bottom 0.508: X5.2 107.8,31.2 104,35 88,35 78,45 78,62 74.8,65.2 ARD1.10
  Bottom 1.016: X5.2 109.2,9.15 X5.3
S5_ON  (via drill 0.5)
  Top 0.508: Q6.1 R8.2 113.95,61.05 v111,64
  Bottom 0.508: v111,64 109.8,65.2 ARD1.19
S6_INPUT  (via drill 0.5)
  Top 0.508: X6.2 127.8,12.8 131,16 R9.1 120.95,19.05 119,21 v119,35
  Bottom 0.508: v119,35 117,37 89,37 80,46 80,63 76,67 76,81 74.02,82.98 ARD1.3
  Bottom 1.016: X6.2 129.2,9.15 X6.3
XB_RX
  Top 0.508: JP1.3 102.05,98.05 101,97 101,63 98.12,60.12 ARD1.17
XB_TX
  Top 0.508: JP1.2 101.05,100.05 99,98 99,64 97.66,62.66 ARD1.18